# EAGLE design complete' (EAGLE 9.1.0)
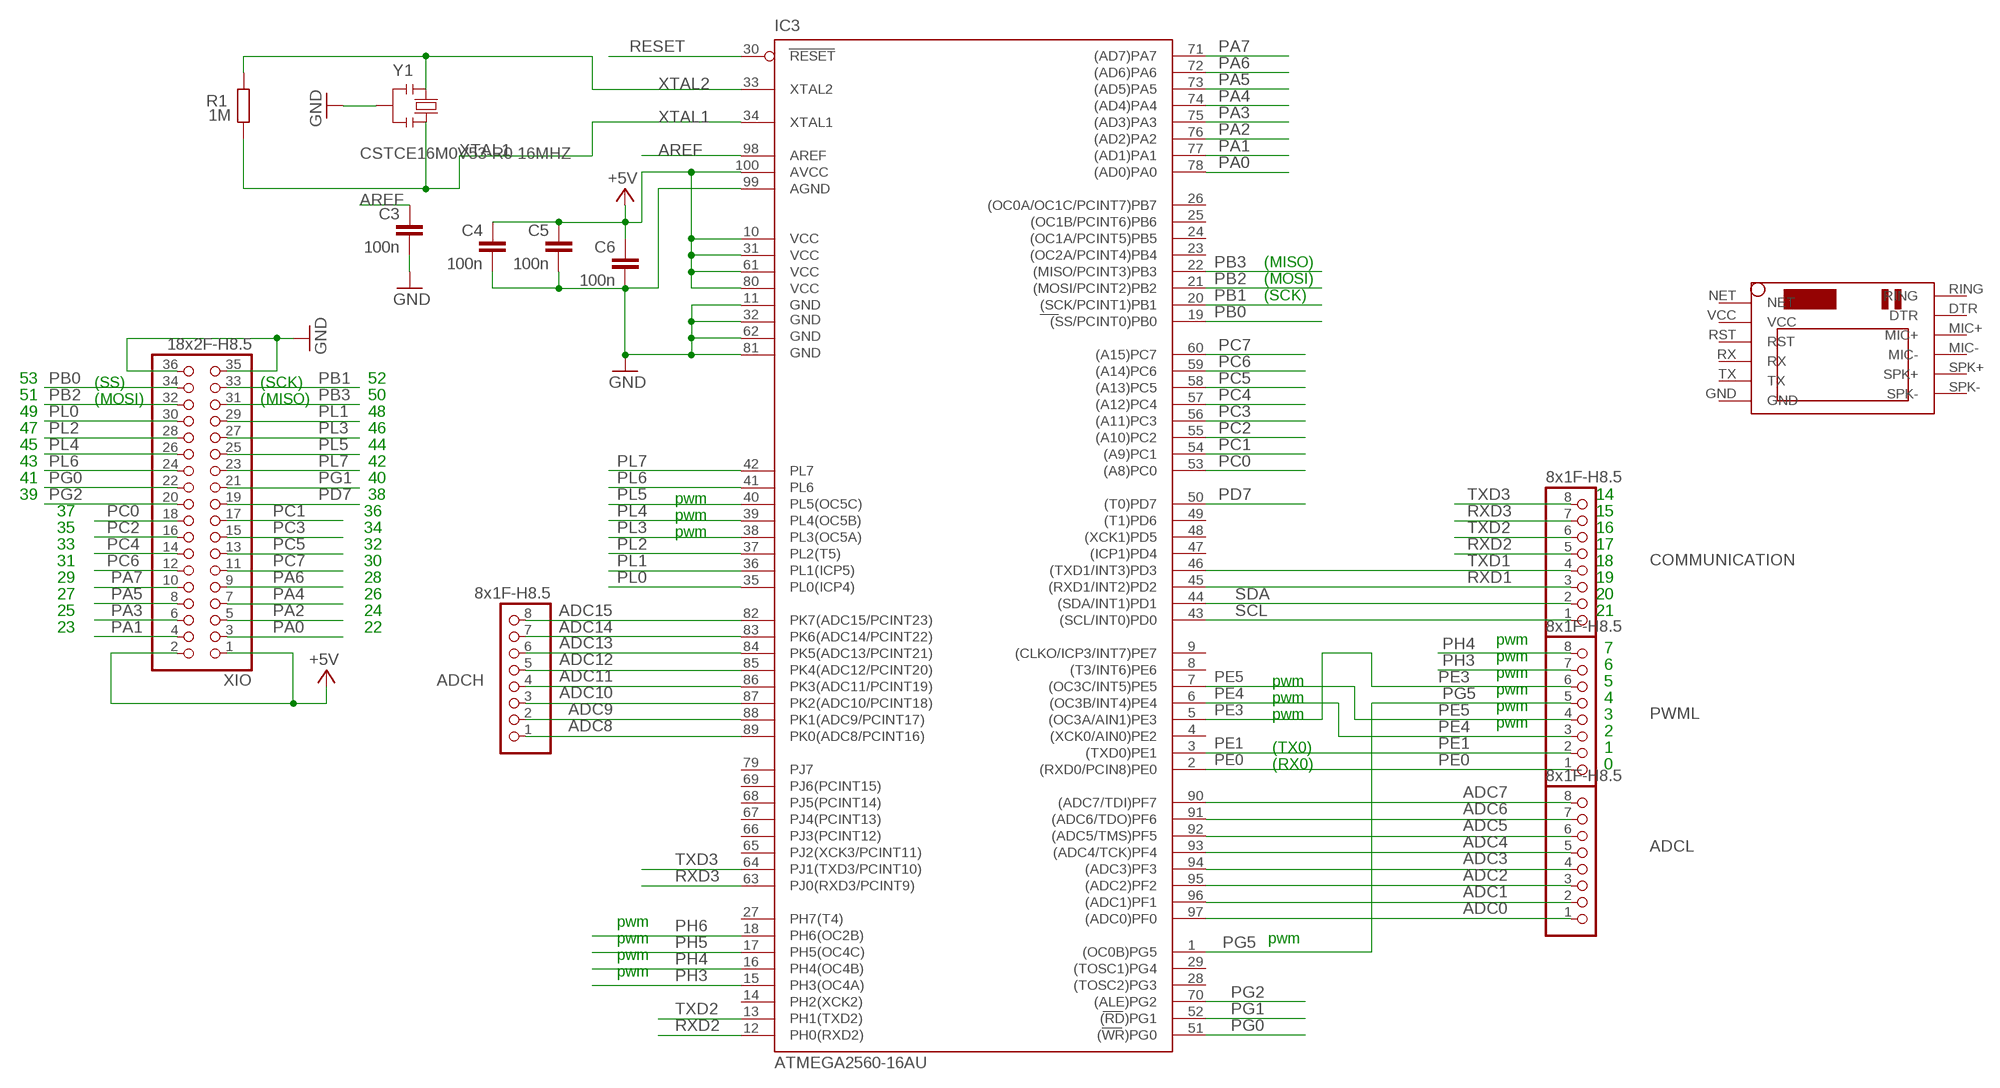
[diagram p0: schematic, sheet 1]

## Parts
ADCH  8x1F-H8.5  PINHD-1X8  [1X08]
ADCL  8x1F-H8.5  PINHD-1X8  [1X08]
C3  100n  C-EU0603-RND  [C0603-ROUND]
C4  100n  C-EU0603-RND  [C0603-ROUND]
C5  100n  C-EU0603-RND  [C0603-ROUND]
C6  100n  C-EU0603-RND  [C0603-ROUND]
COMMUNICATION  8x1F-H8.5  PINHD-1X8  [1X08]
IC3  ATMEGA2560-16AU  ATMEGA25602560-16AU  [TQFP100]
PWML  8x1F-H8.5  PINHD-1X8  [1X08]
R1  1M  R-EU_R0603  [R0603-ROUND]
U$1  SIM800LMODULE  [SIM800LMODULE]
XIO  18x2F-H8.5  PINHD-2X18  [2X18]
Y1  CSTCE16M0V53-R0 16MHZ  RESONATORMU  [RESONATOR]

## Nets
+5V [power usb]: C4.1 C5.1 C6.1 IC3.10(VCC) IC3.31(VCC1) IC3.61(VCC2) IC3.80(VCC3) IC3.100(AVCC) XIO.1 XIO.2
ADC0: ADCL.1 IC3.97((ADC0)PF0)
ADC1: ADCL.2 IC3.96((ADC1)PF1)
ADC2: ADCL.3 IC3.95((ADC2)PF2)
ADC3: ADCL.4 IC3.94((ADC3)PF3)
ADC4: ADCL.5 IC3.93((ADC4/TCK)PF4)
ADC5: ADCL.6 IC3.92((ADC5/TMS)PF5)
ADC6: ADCL.7 IC3.91((ADC6/TDO)PF6)
ADC7: ADCL.8 IC3.90((ADC7/TDI)PF7)
ADC8: ADCH.1 IC3.89(PK0(ADC8/PCINT16))
ADC9: ADCH.2 IC3.88(PK1(ADC9/PCINT17))
ADC10: ADCH.3 IC3.87(PK2(ADC10/PCINT18))
ADC11: ADCH.4 IC3.86(PK3(ADC11/PCINT19))
ADC12: ADCH.5 IC3.85(PK4(ADC12/PCINT20))
ADC13: ADCH.6 IC3.84(PK5(ADC13/PCINT21))
ADC14: ADCH.7 IC3.83(PK6(ADC14/PCINT22))
ADC15: ADCH.8 IC3.82(PK7(ADC15/PCINT23))
AREF: C3.1 IC3.98(AREF)
GND [gnd]: C3.2 C4.2 C5.2 C6.2 IC3.11(GND) IC3.32(GND1) IC3.62(GND2) IC3.81(GND3) IC3.99(AGND) XIO.35 XIO.36 Y1.2
PA0: IC3.78((AD0)PA0) XIO.3
PA1: IC3.77((AD1)PA1) XIO.4
PA2: IC3.76((AD2)PA2) XIO.5
PA3: IC3.75((AD3)PA3) XIO.6
PA4: IC3.74((AD4)PA4) XIO.7
PA5: IC3.73((AD5)PA5) XIO.8
PA6: IC3.72((AD6)PA6) XIO.9
PA7: IC3.71((AD7)PA7) XIO.10
PB0: IC3.19((SS/PCINT0)PB0) XIO.34
PB1: IC3.20((SCK/PCINT1)PB1) XIO.33
PB2: IC3.21((MOSI/PCINT2)PB2) XIO.32
PB3: IC3.22((MISO/PCINT3)PB3) XIO.31
PC0: IC3.53((A8)PC0) XIO.18
PC1: IC3.54((A9)PC1) XIO.17
PC2: IC3.55((A10)PC2) XIO.16
PC3: IC3.56((A11)PC3) XIO.15
PC4: IC3.57((A12)PC4) XIO.14
PC5: IC3.58((A13)PC5) XIO.13
PC6: IC3.59((A14)PC6) XIO.12
PC7: IC3.60((A15)PC7) XIO.11
PD7: IC3.50((T0)PD7) XIO.19
PE0: IC3.2((RXD0/PCIN8)PE0) PWML.1
PE1: IC3.3((TXD0)PE1) PWML.2
PE3: IC3.5((OC3A/AIN1)PE3) PWML.6
PE4: IC3.6((OC3B/INT4)PE4) PWML.3
PE5: IC3.7((OC3C/INT5)PE5) PWML.4
PG0: IC3.51((WR)PG0) XIO.22
PG1: IC3.52((RD)PG1) XIO.21
PG2: IC3.70((ALE)PG2) XIO.20
PG5: IC3.1((OC0B)PG5) PWML.5
PH3: IC3.15(PH3(OC4A)) PWML.7
PH4: IC3.16(PH4(OC4B)) PWML.8
PH5: IC3.17(PH5(OC4C))
PH6: IC3.18(PH6(OC2B))
PL0: IC3.35(PL0(ICP4)) XIO.30
PL1: IC3.36(PL1(ICP5)) XIO.29
PL2: IC3.37(PL2(T5)) XIO.28
PL3: IC3.38(PL3(OC5A)) XIO.27
PL4: IC3.39(PL4(OC5B)) XIO.26
PL5: IC3.40(PL5(OC5C)) XIO.25
PL6: IC3.41(PL6) XIO.24
PL7: IC3.42(PL7) XIO.23
RESET: IC3.30(RESET)
RXD1: COMMUNICATION.3 IC3.45((RXD1/INT2)PD2)
RXD2: COMMUNICATION.5 IC3.12(PH0(RXD2))
RXD3: COMMUNICATION.7 IC3.63(PJ0(RXD3/PCINT9))
SCL: COMMUNICATION.1 IC3.43((SCL/INT0)PD0)
SDA: COMMUNICATION.2 IC3.44((SDA/INT1)PD1)
TXD1: COMMUNICATION.4 IC3.46((TXD1/INT3)PD3)
TXD2: COMMUNICATION.6 IC3.13(PH1(TXD2))
TXD3: COMMUNICATION.8 IC3.64(PJ1(TXD3/PCINT10))
XTAL1: IC3.34(XTAL1) R1.1 Y1.3
XTAL2: IC3.33(XTAL2) R1.2 Y1.1
Unconnected: IC3.4((XCK0/AIN0)PE2) IC3.8((T3/INT6)PE6) IC3.9((CLKO/ICP3/INT7)PE7) IC3.14(PH2(XCK2)) IC3.23((OC2A/PCINT4)PB4) IC3.24((OC1A/PCINT5)PB5) IC3.25((OC1B/PCINT6)PB6) IC3.26((OC0A/OC1C/PCINT7)PB7) IC3.27(PH7(T4)) IC3.28((TOSC2)PG3) IC3.29((TOSC1)PG4) IC3.47((ICP1)PD4) IC3.48((XCK1)PD5) IC3.49((T1)PD6) IC3.65(PJ2(XCK3/PCINT11)) IC3.66(PJ3(PCINT12)) IC3.67(PJ4(PCINT13)) IC3.68(PJ5(PCINT14)) IC3.69(PJ6(PCINT15)) IC3.79(PJ7) U$1.DTR U$1.GND U$1.MIC+ U$1.MIC- U$1.NET U$1.RING U$1.RST U$1.RX U$1.SPK+ U$1.SPK- U$1.TX U$1.VCC

## Notes on the sheet
- (MISO)
- (MOSI)
- (SCK)
- 53 | (SS) | (SCK) | 52
- 51 | (MOSI) | (MISO) | 50
- 49 | 48
- 47 | 46
- 45 | 44
- 43 | 42
- 41 | 40
- 39 | 38 | pwm | 14
- 37 | 36 | pwm | 15
- 35 | 34 | pwm | 16
- 33 | 32 | 17
- 31 | 30 | 18
- 29 | 28 | 19
- 27 | 26 | 20
- 25 | 24 | 21
- 23 | 22
- pwm
- 7
- pwm
- 6
- pwm
- pwm | 5
- pwm
- pwm | 4
- pwm
- pwm | 3
- pwm
- 2
- (TX0) | 1
- (RX0) | 0
- pwm
- pwm | pwm
- pwm
- pwm

## Library data of the parts
ADCH ADCL COMMUNICATION PWML = SmartPrj:PINHD-1X8: PIN HEADER
C3-C6 = SmartPrj:C-EU: CAPACITOR, European symbol
IC3 = SmartPrj:ATMEGA2560: MICROCONTROLLER 64/128/256 Kbytes FLASH 4 Kbytes EEPROM 8 Kbytes SRAM 86 General Purpose I/O pins 12-channels16-bit PWM 4 x Serial USARTs 16-channels 10-bit A/D
R1 = SmartPrj:R-EU_: RESISTOR, European symbol
U$1 = SIM800LMODULE:SIM800LMODULE: SIM800L Module
XIO = SmartPrj:PINHD-2X18: PIN HEADER
Y1 = SmartPrj:RESONATOR

## Net classes
0 default: width 0.203 mm, drill 0.406 mm, clearance 0.203 mm
2 gnd: width 0.305 mm, drill 0.406 mm, clearance 0.203 mm
3 power usb: width 0.508 mm, drill 0.406 mm, clearance 0.203 mm

## Board
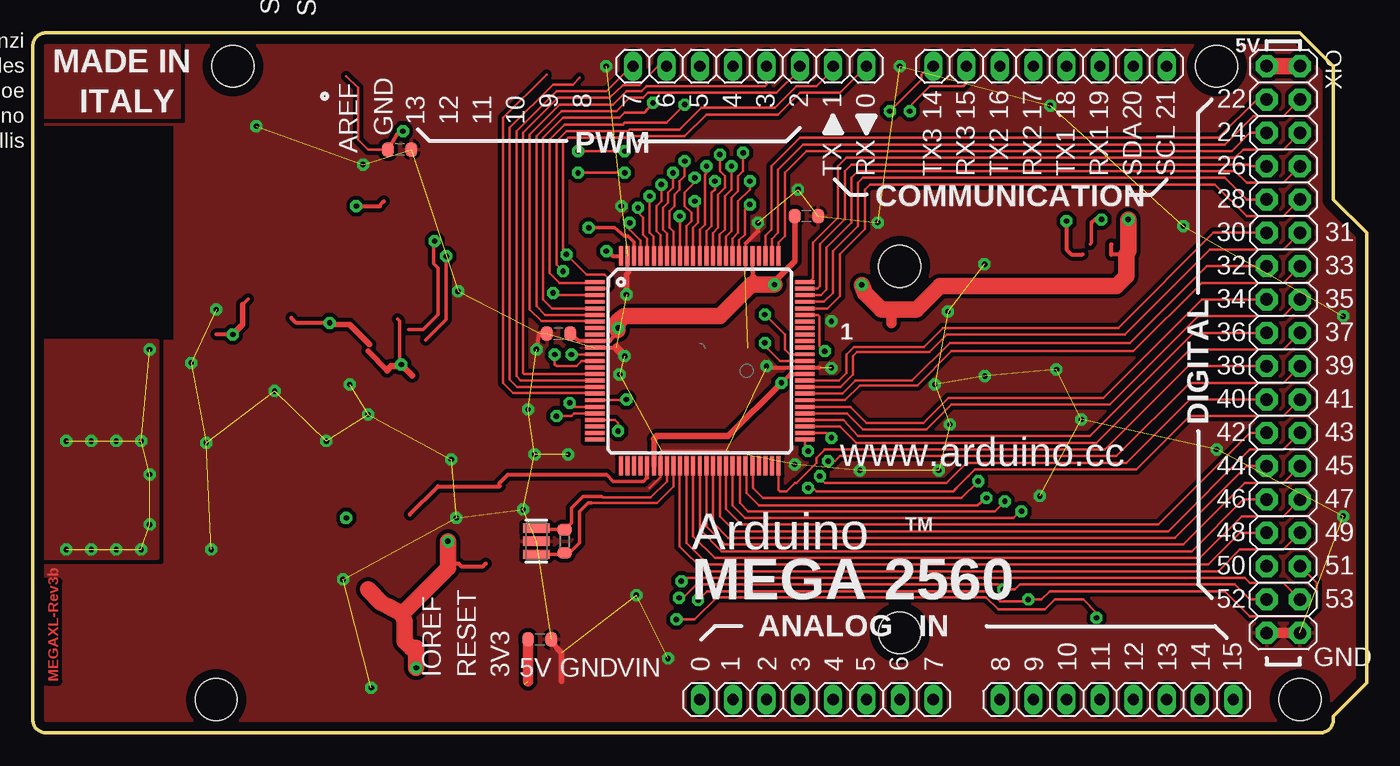
[diagram p1: board, top side]
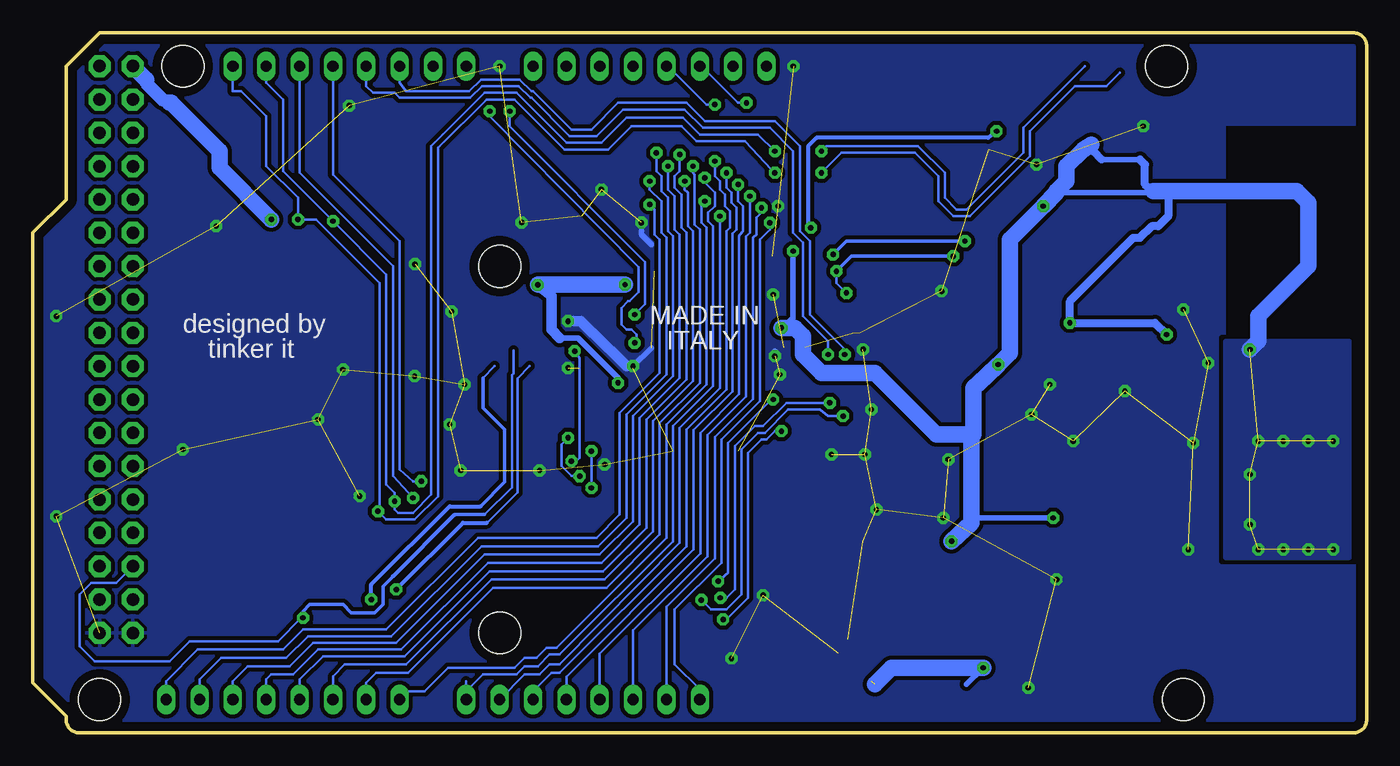
[diagram p2: board, bottom side, seen from below]

Size 101.6 x 53.34 mm. Coordinates in mm from the lower left corner, seen from the top.
Outline: 96.52,53.34 99.06,50.8 99.06,40.64 101.6,38.1 101.6,3.81 99.06,1.27 99.06,1 arc-90 98.06,0 1,0 arc-90 0,1 0,52.34 arc-90 1,53.34 96.52,53.34
Copper layers (1*16): Top 0.035mm / dielectric 1.5mm / Bottom 0.035mm
Design rules "default": minimum track width 8mil, minimum drill 16mil, track to track 7mil, track to pad 7mil, pad to pad 8mil, via to via 10mil, smd to smd 7mil, copper to edge 27mil, drill to drill 12mil, minimum pad ring 10mil, minimum via ring 10mil, stop-mask expansion 2mil, vias tented up to drill 24mil, thermal gap 10mil
Holes 3.2 mm at 96.52,2.54 15.24,50.8 90.17,50.8 13.97,2.54 66.04,35.56 66.04,7.62

### Footprints (pad centres in the part's own frame; a part is rotated, then mirrored left to right if it is on the bottom)
1X08 = drill 0.85 pad 1.422 long: 1 -8.89,0; 2 -6.35,0; 3 -3.81,0; 4 -1.27,0; 5 1.27,0; 6 3.81,0; 7 6.35,0; 8 8.89,0
C0603-ROUND = smd 0.898 x 1.1: 1 -0.889,0; 2 0.889,0
TQFP100 = smd 1.5 x 0.3: 1 -8,6; 2 -8,5.5; 3 -8,5; 4 -8,4.5; 5 -8,4; 6 -8,3.5; 7 -8,3; 8 -8,2.5; 9 -8,2; 10 -8,1.5; 11 -8,1; 12 -8,0.5; 13 -8,0; 14 -8,-0.5; 15 -8,-1; 16 -8,-1.5; 17 -8,-2; 18 -8,-2.5; 19 -8,-3; 20 -8,-3.5; 21 -8,-4; 22 -8,-4.5; 23 -8,-5; 24 -8,-5.5; 25 -8,-6; 51 8,-6; 52 8,-5.5; 53 8,-5; 54 8,-4.5; 55 8,-4; 56 8,-3.5; 57 8,-3; 58 8,-2.5; 59 8,-2; 60 8,-1.5; 61 8,-1; 62 8,-0.5; 63 8,0; 64 8,0.5; 65 8,1; 66 8,1.5; 67 8,2; 68 8,2.5; 69 8,3; 70 8,3.5; 71 8,4; 72 8,4.5; 73 8,5; 74 8,5.5; 75 8,6 | smd 0.3 x 1.5: 26 -6,-8; 27 -5.5,-8; 28 -5,-8; 29 -4.5,-8; 30 -4,-8; 31 -3.5,-8; 32 -3,-8; 33 -2.5,-8; 34 -2,-8; 35 -1.5,-8; 36 -1,-8; 37 -0.5,-8; 38 0,-8; 39 0.5,-8; 40 1,-8; 41 1.5,-8; 42 2,-8; 43 2.5,-8; 44 3,-8; 45 3.5,-8; 46 4,-8; 47 4.5,-8; 48 5,-8; 49 5.5,-8; 50 6,-8; 76 6,8; 77 5.5,8; 78 5,8; 79 4.5,8; 80 4,8; 81 3.5,8; 82 3,8; 83 2.5,8; 84 2,8; 85 1.5,8; 86 1,8; 87 0.5,8; 88 0,8; 89 -0.5,8; 90 -1,8; 91 -1.5,8; 92 -2,8; 93 -2.5,8; 94 -3,8; 95 -3.5,8; 96 -4,8; 97 -4.5,8; 98 -5,8; 99 -5.5,8; 100 -6,8
R0603-ROUND = smd 0.898 x 1.1: 1 -0.889,0; 2 0.889,0
2X18 = drill 0.95 pad 1.676 octagon: 1 -21.59,-1.27; 2 -21.59,1.27; 3 -19.05,-1.27; 4 -19.05,1.27; 5 -16.51,-1.27; 6 -16.51,1.27; 7 -13.97,-1.27; 8 -13.97,1.27; 9 -11.43,-1.27; 10 -11.43,1.27; 11 -8.89,-1.27; 12 -8.89,1.27; 13 -6.35,-1.27; 14 -6.35,1.27; 15 -3.81,-1.27; 16 -3.81,1.27; 17 -1.27,-1.27; 18 -1.27,1.27; 19 1.27,-1.27; 20 1.27,1.27; 21 3.81,-1.27; 22 3.81,1.27; 23 6.35,-1.27; 24 6.35,1.27; 25 8.89,-1.27; 26 8.89,1.27; 27 11.43,-1.27; 28 11.43,1.27; 29 13.97,-1.27; 30 13.97,1.27; 31 16.51,-1.27; 32 16.51,1.27; 33 19.05,-1.27; 34 19.05,1.27; 35 21.59,-1.27; 36 21.59,1.27
RESONATOR = smd 0.7 x 2: 1 -1,0; 2 0,0; 3 1,0

### Placement (x,y rotation side)
ADCH  82.55,2.54 0 top
ADCL  59.69,2.54 0 top
C3  27.94,44.45 0 top
C4  38.61,7.11 0 top
C5  58.93,39.37 0 top
C6  40.05,30.42 180 top
COMMUNICATION  77.47,50.8 180 top
IC3  50.8,28.35 0 top
PWML  54.61,50.8 180 top
R1  40.51,14.61 90 top
XIO  95.25,29.21 270 top
Y1  38.35,14.61 270 top

### Tracks (layer width: path | path; a pad name or v marks a point on that pad's centre or on a via)
+5V  (via drill 0.41)  (11 unrouted)
  Top 0.254: IC3.80 54.81,36.3 54.79,36.27 54.81,36.25 54.81,35.41 | 57.66,27.3 57.7,27.35 | 27.79,31.52 27.94,31.37 27.94,28.64 28,28.19 v28.07,28.07 | 16,32.64 16.41,33.05
  Top 0.305: 54.86,34.67 54.86,35.1 54.81,35.15 54.81,35.41 | 57.7,27.35 IC3.61 | v57.02,26.67 57.66,27.3 | 44.45,30.48 43.94,29.85 IC3.10 41.59,29.85 C6.1 | IC3.100 44.17,36.35 v43.69,36.7 | 83.31,36.45 82.17,36.45 | v24.64,40.13 26.42,40.13 26.74,40.51 | 82.17,36.45 82.15,36.43 | 82.17,36.45 82.17,37.21 82.15,37.23 | v15.24,30.35 13.97,30.35 | 23.6,16.11 v23.88,16.38 | 19.69,31.62 20.07,31.24 v22.61,31.24 | 34.49,12.9 34.29,12.7 32.64,12.7 32.43,12.9 31.93,12.9 31.62,13.21
  Top 0.406: 44.55,30.7 44.45,30.48 v44.58,30.86 | 47.3,22.41 IC3.31 | C5.1 58.04,35.97 56.52,34.42 56.49,34.39 v56.49,34.16 | 26.99,27.62 25.53,29.09 | 25.65,29.59 24.13,31.11 22.73,31.11 v22.61,31.24 | 16,32.64 16,31.11 v15.24,30.35
  Top 0.508: 47.3,22.41 47.5,22.61 52.96,22.61 v57.02,26.67 | 26.99,27.62 27.3,27.94 27.94,27.94 | v28.07,28.07 28.89,27.24
  Top 0.61: v28.07,28.07 27.94,27.94 | 54.86,34.67 54.86,34.29 54.99,34.16
  Top 0.813: 37.72,3.94 C4.1 | 83.31,34.8 83.31,34.92 | 65.41,32.26 65.41,31.24
  Top 1.27: XIO.1 XIO.2 | v63.14,34.14 63.37,33.53 64.64,32.26 65.41,32.26 67.31,32.26 69.09,34.04 82.55,34.04 83.31,34.8 | 83.31,34.92 83.31,36.45 83.44,36.7 v83.44,39.12 | 44.55,30.7 44.55,31.34 45.09,31.75 52.32,31.75 54.74,34.16 54.99,34.16 v56.49,34.16 | v31.62,14.61 31.62,13.21 31.62,12.57 28.13,9.08 | v29.21,4.95 29.21,6.48 28.83,6.48 28.32,6.99 28.32,8.51 28.13,9.08 | 25.53,10.92 26.54,9.91 27.05,9.65 28.13,9.08
  Bottom 0.406: v44.58,30.86 44.58,30.73 43.69,31.62 v43.69,36.7 | 61.47,30.1 60.07,30.1 57.02,27.05 v57.02,26.67 | 23.5,41.15 16.76,41.15 16.64,41.27 16.26,41.27 | 17.27,43.69 20.19,43.69 | v23.88,16.38 30.1,16.38 | v29.21,4.95 30.48,3.68
  Bottom 0.61: 63.12,34.16 v63.14,34.14 | 23.62,41.27 23.5,41.15 | 16.26,41.27 16.89,41.78 16.89,43.31 17.27,43.69 | 20.83,44.32 20.19,43.69 | v15.24,30.35 16.13,31.24 v22.61,31.24 22.61,32.89 17.78,37.72 17.27,37.72 16.38,38.61 15.88,38.61 15.11,39.37 15.11,41.27
  Bottom 0.813: 61.47,30.1 62.1,30.73 62.1,33.27 v63.14,34.14
  Bottom 1.016: 91.19,48.01 91.69,48.26 92.84,49.4 92.96,49.78
  Bottom 1.27: 37.47,3.68 36.2,4.95 v29.21,4.95 | v56.49,34.16 63.12,34.16 | v44.58,30.86 43.56,30.86 42.93,30.23 42.93,28.83 41.53,27.43 37.47,27.43 32.77,22.73 30.1,22.73 | 20.95,44.83 21.59,44.45 22.86,43.18 22.86,42.04 23.62,41.27 23.62,41.15 v24.64,40.13 27.18,37.59 27.18,28.96 v28.07,28.07 28.96,27.18 29.97,26.29 29.97,22.73 30.1,22.73 | 30.1,22.73 30.1,16.38 30.1,16 v31.62,14.61 | v83.44,39.12 87.38,43.05 87.38,44.32 91.06,48.01 91.19,48.01 | v8.89,29.21 8.26,29.84 8.26,31.75 4.45,35.56 4.45,40.39 5.33,41.27 15.11,41.27 16.26,41.27 | 92.96,49.78 XIO.1
  other vias: 6.35,22.23 4.45,22.23 8.26,22.23 2.54,22.23 8.89,19.68 2.54,13.97 6.35,13.97 4.45,13.97 8.89,15.88 8.26,13.97
  pour Top (isolate 0.406, no thermals): 9.53,13.34 9.53,29.84 0.64,29.84 0.64,13.34
  pour Bottom: 1.27,13.34 1.27,29.84 10.79,29.84 10.79,13.34
ADC0  (via drill 0.41)
  Top 0.203: IC3.97 46.3,37.52 45.47,38.35 v45.47,38.86
  Bottom 0.203: ADCL.1 50.8,3.3 52.7,5.21 52.7,9.4 49.15,12.95 49.15,22.35 46.23,25.27 46.23,37.59 45.47,38.35 v45.47,38.86
ADC1  (via drill 0.41)
  Top 0.203: IC3.96 46.8,37.66 46.48,37.97 46.48,39.24 46.1,39.62 v46.1,40.01
  Bottom 0.203: ADCL.2 53.34,9.6 49.63,13.31 49.63,22.55 46.74,25.45 46.74,37.72 46.48,37.97 46.48,39.24 46.1,39.62 v46.1,40.01
ADC2  (via drill 0.41)
  Top 0.203: v46.99,40.89 46.99,38.1 47.27,37.82 47.27,36.68 47.37,36.58 47.3,36.51 47.3,36.38 47.27,36.35 | 47.27,36.35 47.24,36.32 | 47.27,36.35 IC3.95
  Bottom 0.203: ADCL.3 55.88,7.8 50.22,13.46 50.22,22.68 47.27,25.63 47.27,37.82 46.99,38.1 v46.99,40.89
ADC3  (via drill 0.41)
  Top 0.203: IC3.94 47.8,37.92 47.5,38.23 47.5,40.13 47.88,40.51 v47.88,41.78
  Bottom 0.203: ADCL.4 58.42,2.74 58.52,2.85 58.52,3.05 58.42,3.15 58.42,6.02 50.75,13.69 50.75,22.86 47.8,25.81 47.8,37.85 47.75,37.97 47.5,38.23 47.5,40.13 47.88,40.51 v47.88,41.78
ADC4  (via drill 0.41)
  Top 0.203: IC3.93 48.3,38.06 48.01,38.35 48.01,40.01 48.39,40.39 48.39,41.15 48.77,41.53 v48.77,42.67
  Bottom 0.203: 60.96,2.44 ADCL.5 60.96,4.27 51.26,13.97 51.26,23.06 48.31,26.01 48.31,38.05 48.01,38.35 48.01,40.01 48.39,40.39 48.39,41.15 48.77,41.53 v48.77,42.67
ADC5  (via drill 0.41)
  Top 0.203: IC3.92 48.8,38.2 48.51,38.48 48.51,39.75 48.9,40.13 48.9,41.02 49.28,41.4 49.28,42.04 49.66,42.42 v49.66,43.56
  Bottom 0.203: v49.66,43.56 49.66,42.42 49.28,42.04 49.28,41.4 48.9,41.02 48.9,40.13 48.51,39.75 48.51,38.48 48.77,38.23 48.77,26.16 51.82,23.11 51.82,14.22 61.47,4.57 62.1,4.57 63.5,3.17 ADCL.6
ADC6  (via drill 0.41)
  Top 0.203: IC3.91 49.3,39.35 v49.28,39.37
  Bottom 0.203: v49.28,39.37 49.28,26.29 52.32,23.24 52.32,14.48 61.47,5.21 62.23,5.21 62.99,4.45 64.14,4.45 ADCL.7
ADC7  (via drill 0.41)
  Top 0.203: IC3.90 49.8,38.62 50.16,38.99 50.16,39.62 49.66,40.13 49.66,41.15 50.42,41.91 v50.42,42.29
  Bottom 0.203: v50.42,42.29 50.42,41.91 49.66,41.15 49.66,40.13 50.16,39.62 50.16,38.99 49.78,38.61 49.78,26.42 52.83,23.37 52.83,14.61 61.47,5.97 62.23,5.97 63.12,5.08 64.14,5.08 64.77,4.45 67.31,4.45 68.58,3.17 | 68.58,3.17 ADCL.8 | 68.58,3.17 68.58,3.94
ADC8  (via drill 0.41)
  Top 0.203: IC3.89 50.3,38.49 50.67,38.86 50.67,40.26 v50.42,40.51
  Bottom 0.203: v50.42,40.51 50.67,40.26 50.67,38.86 50.29,38.48 50.29,26.54 53.34,23.5 53.34,14.86 61.72,6.48 62.48,6.48 63.25,5.71 64.14,5.71 64.9,4.95 69.98,4.95 71.75,3.17 73.66,3.17 ADCH.1
ADC9  (via drill 0.41)
  Top 0.203: IC3.88 50.8,38.35 51.18,38.73 51.18,42.55 51.31,42.67 v51.31,43.18
  Bottom 0.203: v51.31,43.18 51.31,42.67 51.18,42.55 51.18,38.73 50.8,38.35 50.8,26.67 53.85,23.62 53.85,15.11 57.91,11.05 66.55,11.05 73.03,4.57 75.44,4.57 76.2,3.81 ADCH.2
ADC10  (via drill 0.41)
  Top 0.203: IC3.87 51.3,38.22 51.69,38.61 51.69,41.15 51.94,41.4 v51.94,42.04
  Bottom 0.203: v51.94,42.04 51.94,41.4 51.69,41.15 51.69,38.61 51.31,38.23 51.31,26.8 54.36,23.75 54.36,15.37 58.04,11.68 66.67,11.68 73.15,5.21 77.85,5.21 78.74,4.32 ADCH.3
ADC11  (via drill 0.41)
  Top 0.203: IC3.86 51.8,38.08 52.2,38.48 52.2,41.02 52.7,41.53 52.7,42.42 52.32,42.8 v52.32,44.07
  Bottom 0.203: v52.32,44.07 52.32,42.8 52.7,42.42 52.7,41.53 52.2,41.02 52.2,38.48 51.82,38.1 51.82,26.92 54.86,23.88 54.86,15.62 58.17,12.32 66.8,12.32 73.28,5.84 79.5,5.84 81.28,4.06 ADCH.4
ADC12  (via drill 0.41)
  Top 0.203: IC3.85 52.3,37.95 52.7,38.35 52.7,40.89 53.21,41.4 v53.21,43.18
  Bottom 0.203: v53.21,43.18 53.21,41.4 52.7,40.89 52.7,38.35 52.32,37.97 52.32,27.05 55.37,24 55.37,15.88 58.29,12.95 66.93,12.95 73.53,6.35 79.88,6.35 81.79,4.45 83.44,4.45 83.82,4.06 ADCH.5
ADC13  (via drill 0.41)
  Top 0.203: IC3.84 52.8,37.81 53.21,38.23 53.21,40.77 53.72,41.27 53.72,42.42 54.1,42.8 v54.1,44.2
  Bottom 0.203: v54.1,44.2 54.1,42.8 53.72,42.42 53.72,41.27 53.21,40.77 53.21,38.23 52.83,37.85 52.83,27.18 55.88,24.13 55.88,16.13 58.42,13.59 67.18,13.59 73.91,6.86 80.26,6.86 82.04,5.08 85.22,5.08 86.36,3.94 ADCH.6
ADC14  (via drill 0.41)
  Top 0.203: IC3.83 53.3,37.68 53.72,38.1 53.72,40.51 54.61,41.4 v54.61,42.04
  Bottom 0.203: v54.61,42.04 54.61,41.4 53.72,40.51 53.72,38.1 53.34,37.72 53.34,27.3 56.39,24.26 56.39,16.38 58.55,14.22 67.44,14.22 74.3,7.37 80.64,7.37 82.3,5.71 87.25,5.71 88.9,4.06 ADCH.7
ADC15  (via drill 0.41)
  Top 0.203: IC3.82 53.8,37.54 54.23,37.97 54.23,39.88 v54.61,40.26
  Bottom 0.203: v54.61,40.26 54.23,39.88 54.23,37.97 53.85,37.59 53.85,27.43 56.9,24.38 56.9,16.64 58.67,14.86 67.69,14.86 74.68,7.87 81.03,7.87 82.55,6.35 89.03,6.35 91.44,3.94 ADCH.8
AREF  (via drill 0.41)
  Top 0.203: C3.1 25.53,44.45 24.77,45.21 24.77,49.15 23.88,50.04
  Top 0.254: IC3.98 45.8,37.38 45.34,37.85 45.09,37.85 44.32,38.48 v42.34,38.48
  Top 0.305: v28.19,45.85 27.73,45.59 C3.1
  Bottom 0.305: v28.19,45.85 28.83,45.34 41.91,45.34 42.55,44.7 42.55,38.66 v42.34,38.48
GND  (via drill 0.41)  (55 unrouted)
  Top 0.203: 54.23,35.18 54.3,35.25 IC3.81 54.33,36.35 | 54.3,37.28 54.3,36.38 54.33,36.35 | IC3.32 47.8,21.39 47.88,21.46 52.83,21.46 | IC3.32 | IC3.32 47.8,19.48 46.99,18.67 | 54.33,36.35 54.36,36.32
  Top 0.305: 45.39,35.1 45.29,35.2 IC3.99 | IC3.11 42.86,29.35 42.88,29.36 44.32,29.36 | 44.32,29.36 44.4,29.36 | 56.06,27.86 56.08,27.84 58.81,27.84 | 58.83,27.84 58.82,27.85 IC3.62 58.81,27.84 | 54.3,37.28 55.24,38.23 v55.24,38.86 | 44.32,29.36 44.32,29.34 44.35,29.36 44.42,29.36 | v38.35,29.23 38.61,30.48 | 59.94,27.81 59.92,27.84 58.81,27.84
  Top 0.406: 40.26,3.94 40.26,6.1 39.88,6.48 C4.2 | 56.06,27.86 56.01,27.81 v55.88,27.94 | v45.21,33.4 45.21,34.92 45.39,35.1
  Top 0.61: v55.88,27.94 55.88,27.81 | 44.42,29.36 v45.09,28.7
  Top 0.813: XIO.35 XIO.36
  Bottom 0.406: v45.09,28.7 45.09,29.08 | v55.24,38.86 55.24,37.97 54.48,37.21 | v55.88,27.94 54.48,29.34
  Bottom 0.813: v60.83,31.37 59.87,31.37 58.98,30.48 58.93,30.48 56.39,27.94 v55.88,27.94 | 93.73,7.87 XIO.35
  other vias: 69,20 38.23,21.21 32.38,33.66 87.63,38.61 90.17,21.59 72.49,35.71 23.62,11.68 13.59,13.97 32.26,16.38 40.77,21.21 17.02,46.23 25.53,24.26 58.29,41.4 77.5,47.8 44.83,40.13 44.7,27.3 48.39,5.67 25.78,3.43 13.21,22.1 24.13,26.54 25.15,43.31 60.83,27.81 58.04,20.45 12.06,28.19 37.72,24.64 77.98,27.69 76.71,18.04 99.81,31.75 79.88,23.88 69.85,23.5 72.52,27.18 18.41,26.04 69.71,32.1 63,20 99.81,16.51 66.04,50.8 43.67,50.8 13.97,32.26 64.36,38.89 68.71,26.54 37.34,17.02 31.88,20.83 22.35,22.23 45.97,10.49
  pour Top (isolate 0.305, rank 2): 0.64,52.7 101.6,52.7 101.6,0.64 0.64,0.64 0.64,29.84 10.79,29.84 10.79,46.35 0.64,46.35
  pour Bottom (isolate 0.305, rank 2): 0.64,52.7 101.6,52.7 102.23,52.07 102.23,0.64 1.27,0.64 0.64,1.27 0.64,29.84 10.79,29.84 10.79,46.35 0.64,46.35
N$1
  pour Top: 0.64,52.7 10.79,52.7 11.18,52.7 11.18,46.86 0.64,46.86
PA0
  Top 0.203: IC3.78 55.8,37.89 56.26,38.35 56.26,43.18 58.42,45.34 90.3,45.34 93.22,48.26 XIO.3
PA1
  Top 0.203: IC3.77 56.3,37.63 56.77,38.1 56.77,42.93 58.67,44.83 90.81,44.83 92.96,46.99 95.25,46.99 XIO.4
PA2
  Top 0.203: XIO.5 92.71,45.72 91.31,44.32 58.93,44.32 57.28,42.67 57.28,37.85 56.8,37.37 IC3.76
PA3
  Top 0.203: XIO.6 95.25,44.45 92.2,44.45 91.57,43.81 61.98,43.81 61.34,43.18 61.34,39.26 59.44,37.35 59.44,34.67 59.11,34.35 IC3.75
PA4
  Top 0.203: IC3.74 59.75,33.85 59.94,34.04 59.94,37.23 61.85,39.13 61.85,42.8 62.36,43.31 92.58,43.31 92.71,43.18 XIO.7
PA5
  Top 0.203: IC3.73 60.02,33.35 60.45,33.78 60.45,36.97 62.36,38.88 62.36,42.29 62.87,42.8 91.57,42.8 92.46,41.91 95.25,41.91 XIO.8
PA6
  Top 0.203: IC3.72 60.28,32.85 60.96,33.53 60.96,36.72 62.87,38.62 62.87,41.91 63.25,42.29 90.81,42.29 92.46,40.64 XIO.9
PA7
  Top 0.203: IC3.71 60.54,32.35 61.47,33.27 61.47,36.47 63.37,38.37 63.37,41.4 63.75,41.78 90.04,41.78 92.46,39.37 95.25,39.37 XIO.10
PB0  (via drill 0.41)
  Top 0.203: IC3.19 45.39,25.35 v45.21,25.4 | v49.4,11.56 49.53,11.56 49.78,11.81 92.33,11.81 92.71,11.43 95.25,11.43 XIO.34
  Bottom 0.203: v45.21,25.4 45.34,25.4 48.64,22.1 48.64,12.19 v49.4,11.56
PB1  (via drill 0.41)
  Top 0.203: IC3.20 41.19,24.85 v40.89,25.15 | XIO.33 92.71,10.16 91.57,11.3 75.18,11.3 74.8,10.92 v73.91,10.92 73.53,11.3 50.55,11.3 49.53,10.29 v49.23,10.29
  Bottom 0.203: v40.89,25.15 44.2,25.15 45.97,23.37 46.61,23.37 48.13,21.84 48.13,10.92 48.77,10.29 v49.23,10.29 | 63.75,27.94 64.69,27 64.69,18.31 67,16
  Bottom 0.305: 67,16 68.83,16 v73.91,10.92
PB2  (via drill 0.41)
  Top 0.203: IC3.21 41.24,24.35 41.02,24.13 v39.88,24.13 | XIO.32 97.79,11.43 97.79,9.53 97.16,8.89 92.71,8.89 90.81,10.79 77.47,10.79 76.83,10.16 v75.82,10.16 75.69,10.03 73.66,10.03 72.9,10.79 51.34,10.79 v50.67,10.12
  Bottom 0.203: v39.88,24.13 41.02,24.13 41.66,24.64 44.07,24.64 45.85,22.86 46.35,22.86 47.62,21.59 47.62,10.54 48.77,9.4 49.95,9.4 v50.67,10.12 | 67.31,27.05 66.42,27.94
  Bottom 0.254: 67.31,27.05 67.31,24.77 65.66,23.11 65.66,19.11 67.49,17.27
  Bottom 0.305: 67.49,17.27 69.85,17.27 75.82,11.3 v75.82,10.16
PB3  (via drill 0.41)
  Top 0.203: IC3.22 44.35,23.85 44.58,23.62 v44.58,22.99 | v81.03,8.76 81.03,9.14 80.01,10.16 77.85,10.16 77.09,9.4 73.53,9.4 72.59,10.34 52.12,10.34 50.42,8.64 v49.02,8.64
  Bottom 0.203: v81.03,8.76 81.15,8.76 82.93,6.99 89.66,6.99 91.19,5.46 96.9,5.46 98.04,6.6 98.04,10.54 97.16,11.43 95.25,11.43 XIO.31 | v44.58,22.99 45.09,22.99 45.72,22.35 46.1,22.35 47.12,21.34 47.12,10.29 48.77,8.64 v49.02,8.64 | 64.97,29.13 64.97,27.38 65.1,27.25 65.1,18.72 67.18,16.64
  Bottom 0.254: v81.03,8.76 81.03,9.27 80.52,9.78 77.98,9.78 77.34,9.14 75.56,9.14 74.93,9.78 74.93,11.18 74.17,11.94 | 69.47,16.64 67.18,16.64
  Bottom 0.305: 74.17,11.94 69.47,16.64
PC0
  Top 0.203: IC3.53 61.49,23.35 62.74,22.1 81.03,22.1 88.14,29.21 95.25,29.21 XIO.18
PC1
  Top 0.203: IC3.54 61.75,23.85 62.87,22.61 80.52,22.61 88.39,30.48 XIO.17
PC2
  Top 0.203: IC3.55 62.01,24.35 63.25,23.11 68.07,23.11 69.98,25.02 82.04,25.02 88.77,31.75 95.25,31.75 XIO.16
PC3
  Top 0.203: IC3.56 62.28,24.85 63.5,23.62 67.82,23.62 69.72,25.53 81.53,25.53 89.03,33.02 XIO.15
PC4
  Top 0.203: IC3.57 61.85,25.35 62.99,26.48 67.39,26.48 69.98,29.08 83.82,29.08 89.03,34.29 95.25,34.29 XIO.14
PC5
  Top 0.203: IC3.58 61.66,25.85 62.66,26.86 66.98,26.86 69.85,29.72 83.57,29.72 89.41,35.56 XIO.13
PC6
  Top 0.203: IC3.59 61.52,26.35 62.48,27.3 62.48,28.7 62.79,29.02 68.28,29.02 69.62,30.35 83.19,30.35 89.66,36.83 95.25,36.83 XIO.12
PC7
  Top 0.203: IC3.60 61.39,26.85 61.98,27.43 61.98,28.83 62.56,29.4 67.87,29.4 69.32,30.86 82.68,30.86 89.92,38.1 XIO.11
PD7
  Top 0.203: XIO.19 88.01,27.94 81.66,21.59 60.3,21.59 60.3,21.57 59.69,20.95 59.69,20.57 58.17,19.05 58.04,19.05 57.4,18.41 56.9,18.41 56.8,18.51 IC3.50
PE0  (via drill 0.41)
  Top 0.203: PWML.1 61.47,48.77 58.42,48.77 56.77,47.12 51.31,47.12 49.66,45.47 45.85,45.47 45.72,45.34 40.77,45.34 40.39,44.96 40.39,36.7 v40.64,36.45 42.16,34.92 43.56,34.92 43.94,34.54 43.94,34.04 43.75,33.85 IC3.2
  Top 0.254: v30.61,37.47 30.54,37.4 30.54,35.74 30.86,35.43 30.86,31.88 29.72,30.73 28.63,30.73
  Bottom 0.254: v30.61,37.47 39.62,37.47 v40.64,36.45
PE1  (via drill 0.41)
  Top 0.203: v40.39,35.18 39.88,35.69 39.88,45.09 40.64,45.85 45.34,45.85 45.47,45.97 49.28,45.97 50.93,47.62 56.52,47.62 58.17,49.28 59.69,49.28 60.96,50.55 PWML.2 | v39.62,33.53 39.88,33.27 39.95,33.35 IC3.3
  Top 0.254: 29.91,29.91 31.5,31.5 v31.5,36.32
  Bottom 0.203: v40.39,35.18 40.39,34.29 v39.62,33.53
  Bottom 0.254: v31.5,36.32 39.24,36.32 v40.39,35.18
PE3  (via drill 0.41)
  Top 0.203: IC3.5 39.54,32.35 38.86,33.02 38.86,45.34 40.39,46.86 44.7,46.86 45.09,47.24 46.61,47.24 v47.24,48.01
  Bottom 0.203: PWML.6 50.67,50.8 47.88,48.01 v47.24,48.01
PE4
  Top 0.203: IC3.6 39.02,31.85 38.35,32.51 38.35,45.47 40.26,47.37 44.45,47.37 45.47,48.39 46.48,48.39 46.86,48.77 56.64,48.77 58.42,50.55 PWML.3
PE5
  Top 0.203: IC3.7 42.78,31.35 42.55,31.37 38.73,31.37 37.85,32.26 37.85,45.59 40.13,47.88 44.2,47.88 45.21,48.9 46.35,48.9 46.74,49.28 55.75,49.28 55.88,49.4 PWML.4
PG0  (via drill 0.41)
  Top 0.203: IC3.51 58.8,21.84 v59.05,21.46 | XIO.22 95.25,24.13 88.14,24.13 84.07,20.07 71.75,20.07 71.25,19.56 70.36,18.67 70.1,18.41 59.69,18.41 59.44,18.67 v59.05,18.67
  Bottom 0.203: v59.05,18.67 v59.05,21.46
PG1  (via drill 0.41)
  Top 0.203: IC3.52 60.44,22.85 v60.83,22.48 | XIO.21 88.14,25.4 83.31,20.57 71.12,20.57 69.6,19.05 60.33,19.05 59.94,19.43 v59.94,19.56
  Bottom 0.203: v59.94,19.56 60.58,19.56 61.34,20.32 61.34,21.97 v60.83,22.48
PG2  (via drill 0.41)
  Top 0.203: IC3.70 59.8,31.85 59.92,31.73 59.92,29.49 v60.33,29.08 | v60.58,20.7 61.09,20.7 61.47,21.08 82.55,21.08 88.14,26.67 95.25,26.67 XIO.20
  Bottom 0.203: v60.58,20.7 60.2,20.7 59.94,20.95 59.94,28.57 v60.33,29.08
PG5  (via drill 0.41)
  Top 0.203: IC3.1 42.73,34.35 42.67,34.29 40.13,34.29 39.37,35.05 39.37,45.21 40.51,46.35 44.96,46.35 45.09,46.48 48.26,46.48 v49.66,47.88
  Bottom 0.203: PWML.5 53.21,50.8 50.29,47.88 v49.66,47.88
PH3
  Top 0.203: IC3.15 37.42,27.35 37.34,27.43 37.34,45.72 40.01,48.39 43.94,48.39 44.96,49.35 46.23,49.35 47.62,50.8 PWML.7
PH4
  Top 0.203: IC3.16 37.16,26.85 36.83,27.18 36.83,45.85 39.88,48.9 43.69,48.9 45.59,50.8 PWML.8
PH5
  Top 0.203: IC3.17 36.9,26.35 36.32,26.92 36.32,46.1 39.62,49.4 41.15,49.4 41.66,49.91
PH6
  Top 0.203: IC3.18 42.73,25.85 42.67,25.91 36.58,25.91 35.81,26.67 35.81,46.86 39.12,50.16
PL0
  Top 0.203: 49.28,20.3 49.28,14.22 51.18,12.32 90.3,12.32 91.95,13.97 95.25,13.97 XIO.30
  Top 0.254: IC3.35 49.3,20.32 49.28,20.3
PL1
  Top 0.203: IC3.36 49.8,14.46 51.44,12.83 89.53,12.83 91.95,15.24 XIO.29
PL2
  Top 0.203: 50.29,20.3 50.29,14.99 51.94,13.34 88.9,13.34 92.08,16.51 95.25,16.51 XIO.28
  Top 0.254: IC3.37 50.27,20.32 50.29,20.3
PL3
  Top 0.203: IC3.38 50.8,15.49 52.45,13.84 88.27,13.84 92.2,17.78 XIO.27
PL4
  Top 0.203: 51.31,20.22 51.31,15.75 52.7,14.35 87.63,14.35 92.33,19.05 95.25,19.05 XIO.26
  Top 0.254: IC3.39 51.3,20.28 51.33,20.24 51.31,20.22
PL5
  Top 0.203: IC3.40 51.8,16.02 52.96,14.86 87,14.86 92.46,20.32 XIO.25
PL6
  Top 0.203: 52.32,20.24 52.32,16.51 53.47,15.37 86.49,15.37 92.71,21.59 95.25,21.59 XIO.24
  Top 0.254: IC3.41 52.3,20.32 52.27,20.3 52.32,20.24
PL7
  Top 0.203: IC3.42 52.8,17.05 53.98,15.88 85.72,15.88 92.71,22.86 XIO.23
RESET
  Top 0.254: 46.8,19.44 46.53,19.18 44.2,19.18 43.69,19.68
  Top 0.305: 46.8,19.44 IC3.30 | 43.69,19.68 36.2,19.68 35.56,19.05 35.56,18.8 30.86,18.8 28.7,16.64
RXD1  (via drill 0.41)
  Top 0.203: IC3.45 54.33,20.35 54.36,20.32 54.36,18.29 55.3,17.35 71.96,17.35 v72.64,17.91
  Bottom 0.203: COMMUNICATION.3 81.28,42.67 74.17,35.56 74.17,19.56 v72.64,17.91
RXD2  (via drill 0.41)
  Top 0.203: IC3.12 41.04,28.85 v41.02,28.83
  Bottom 0.203: v41.02,28.83 41.02,29.84 42.93,31.75 42.93,37.34 43.69,38.1 43.69,44.32 45.47,46.1 50.55,46.1 51.94,47.5 56.64,47.5 58.67,45.47 60.71,45.47 63.63,48.39 63.7,48.39 64.59,49.28 67.39,49.28 68.28,48.39 73.66,48.39 74.04,48.77 75.69,48.77 76.2,49.28 COMMUNICATION.5
RXD3  (via drill 0.41)
  Top 0.203: COMMUNICATION.7 71.12,49.53 70.87,49.28 68.33,49.28 66.8,47.75 v66.8,47.37 | v55.75,29.72 55.75,29.46 56.9,28.32 58.8,28.32 IC3.63
  Bottom 0.203: v66.8,47.37 66.8,46.99 55.45,35.51 55.45,33.6 56.13,32.89 56.26,32.89 56.77,32.38 56.77,31.11 56.39,30.73 56.01,30.73 55.63,30.35 55.63,29.84 v55.75,29.72
SCL  (via drill 0.41)
  Top 0.203: IC3.43 53.3,17.31 54.23,16.38 74.68,16.38 75.06,16.76 v75.31,16.89 | v41.53,42.67 v45.09,42.67
  Top 0.254: 80.54,37.23 80.64,37.34 80.64,38.86
  Top 0.305: v81.41,39.12 80.9,39.12 80.64,38.86
  Bottom 0.203: COMMUNICATION.1 86.36,48.9 85.72,48.9 83.82,46.99 83.82,43.18 81.41,40.77 v81.41,39.12 80.01,39.12 75.18,34.29 75.18,17.02 v75.31,16.89 74.68,16.26 72.52,16.26 70.74,18.03 70.74,44.58 67.06,48.26 64.9,48.26 61.09,44.45 57.78,44.45 56.01,46.23 52.2,46.23 51.05,45.09 47.37,45.09 45.34,42.93 v45.09,42.67 | 18.8,50.29 19.81,49.28 22.23,49.28 25.65,45.85 25.65,43.94 30.23,39.37 31.5,39.37 32.64,40.51 32.64,42.42 34.42,44.2 40.01,44.2 v41.53,42.67
SDA  (via drill 0.41)
  Top 0.203: v74.04,17.65 73.28,16.89 54.48,16.89 53.85,17.53 53.85,19.94 53.8,20.04 53.8,20.14 IC3.44 | v41.53,44.32 v45.09,44.32
  Top 0.305: v78.74,38.99 78.74,36.83 79.12,36.45 79.95,36.45
  Bottom 0.203: COMMUNICATION.2 83.82,49.53 82.55,48.26 82.55,42.8 v78.74,38.99 74.68,34.92 74.68,18.92 74.04,18.29 v74.04,17.65 74.04,17.02 73.79,16.76 72.64,16.76 71.25,18.16 71.25,44.7 67.18,48.77 64.77,48.77 60.96,44.96 58.29,44.96 56.39,46.86 52.07,46.86 50.8,45.59 46.35,45.59 v45.09,44.32 | 21.46,50.8 26.16,46.1 26.16,44.2 30.48,39.88 31.24,39.88 32.13,40.77 32.13,42.67 34.16,44.7 41.15,44.7 v41.53,44.32
TXD1  (via drill 0.41)
  Top 0.203: IC3.46 54.8,20.26 54.86,20.19 54.86,18.67 55.63,17.91 70.74,17.91 v72.01,19.18
  Bottom 0.203: COMMUNICATION.4 78.74,42.55 73.66,37.47 73.66,20.07 72.64,19.18 v72.01,19.18
TXD2  (via drill 0.41)
  Top 0.203: IC3.13 41.81,28.35 41.4,27.94 39.88,27.94 39.75,28.07 v39.75,28.83
  Bottom 0.203: v39.75,28.83 39.75,29.21 42.42,31.88 42.42,37.47 43.18,38.23 43.18,44.7 45.09,46.61 50.42,46.61 51.82,48.01 57.02,48.01 59.05,45.97 60.58,45.97 63.5,48.9 63.63,48.9 64.52,49.78 67.46,49.78 68.35,48.9 73.15,48.9 73.66,49.53 COMMUNICATION.6
TXD3  (via drill 0.41)
  Top 0.203: COMMUNICATION.8 68.33,50.8 67.69,50.16 67.69,49.78 v65.28,47.37 | IC3.64 58.66,28.85 58.55,28.83 57.66,28.83 57.28,29.21 57.28,30.35 v55.75,31.88
  Bottom 0.203: v65.28,47.37 65.28,46.23 54.97,35.89 54.97,32.66 v55.75,31.88
XTAL1
  Top 0.203: IC3.34 48.8,18.8 47.53,17.53 42.55,17.53
  Top 0.254: Y1.3 39.89,13.61 R1.1 40.89,13.72 41.66,14.48 41.66,16.89 42.29,17.53 42.55,17.53
XTAL2
  Top 0.203: 43.31,18.03 43.41,17.93 47.05,17.93 48.3,19.18 IC3.33
  Top 0.254: 37.83,15.61 Y1.1 37.96,15.61 38.07,15.49 R1.2 41.02,16 41.02,17.14 41.91,18.03 43.31,18.03

### Text on the board
Top: MEGAXL-Rev3b
tPlace: 9 | 8 | 7 | 6 | 5 | 4 | 3 | 2 | 1 | 0 | 22 | 14 | 15 | 16 | 17 | 18 | 19 | 20 | 21 | 13 | 12 | 11 | 10 | 24 | 26 | 28 | 30 | 31 | 32 | 33 | 34 | 35 | 36 | 37 | 38 | 39 | 40 | 41 | 42 | 43 | www.arduino.cc | 44 | 45 | 46 | 47 | TM | 48 | 49 | 50 | 51 | 52 | 53 | 0 | 1 | 2 | 3 | 4 | 5 | 6 | 7 | 8 | 9 | 10 | 11 | 12 | 13 | 14 | 15
tNames: SCL | SDA | M.Banzi | 5V | D.Cuartielles | T.Igoe | MADE IN | G.Martino | ITALY | D.Mellis | GND | AREF | PWM | TX | RX | TX3 | RX3 | TX2 | RX2 | TX1 | RX1 | SDA | SCL | 1 | DIGITAL | Arduino | MEGA 2560 | ANALOG IN | GND | IOREF | RESET | 3V3 | 5V | GND | VIN
bNames: MADE IN | designed by | ITALY | tinker it
ReferenceLC: L | ON | TX | RX | PC1 | PC2